# Altium schematic sheet F100C4T6B.SchDoc
size A4
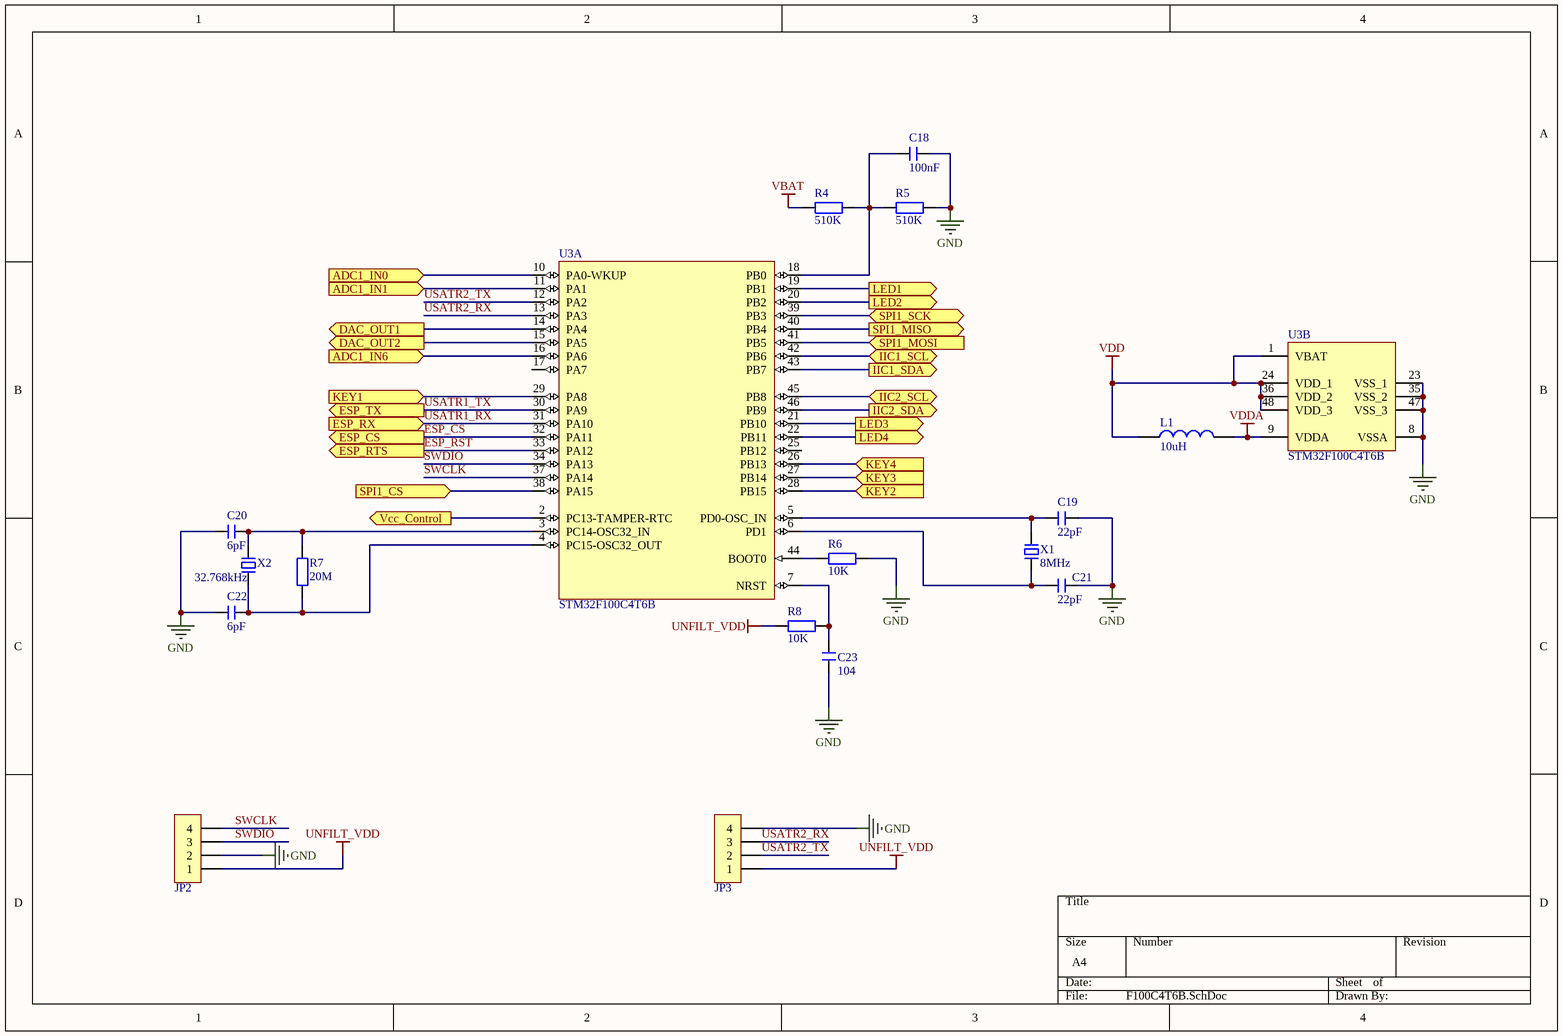
[diagram p0: F100C4T6B.SchDoc]

## Parts
C18  100nF  [C 0603_L]
C19  22pF  [C 0603_L]
C20  6pF  [C 0603_L]
C21  22pF  [C 0603_L]
C22  6pF  [C 0603_L]
C23  104  [C 0603_L]
JP2  HDR-1X4  [HDR2.54-LI-4P]  (value not drawn)
JP3  HDR-1X4  [HDR2.54-LI-4P]  (value not drawn)
L1  10uH  [L 0805]
R4  510K  [R 0603_L]
R5  510K  [R 0603_L]
R6  10K  [R 0603_L]
R7  20M  [R 0603_L]
R8  10K  [R 0603_L]
U3  STM32F100C4T6B  [LQFP48_N]  (parts A,B of 2)
X1  8MHz  [OSC 5032-2P]
X2  32.768kHz  [OSC 3215-2P]

## Ports
ADC1_IN0 (in), ADC1_IN1 (in), ADC1_IN6 (in), DAC_OUT1 (out), DAC_OUT2 (out), ESP_CS (out), ESP_RTS (out), ESP_RX (in), ESP_TX (out), IIC1_SCL (bidir), IIC1_SDA (out), IIC2_SCL (bidir), IIC2_SDA (out), KEY1 (in), KEY2 (in), KEY3 (in), KEY4 (in), LED1 (out), LED2 (out), LED3 (out), LED4 (out), SPI1_CS (in), SPI1_MISO (out), SPI1_MOSI (in), SPI1_SCK (bidir), Vcc_Control (out)

## Nets
GND: C18.1 C19.2 C20.2 C21.2 C22.2 C23.1 JP2.2 JP3.4 R5.1 R6.2 U3.8(VSSA) U3.23(VSS_1) U3.35(VSS_2) U3.47(VSS_3)
UNFILT_VDD: JP2.1 JP3.1 R8.2
VBAT: R4.2
VDD: L1.1 U3.1(VBAT) U3.24(VDD_1) U3.36(VDD_2) U3.48(VDD_3)
VDDA: L1.2 U3.9(VDDA)
ADC1_IN0: U3.10(PA0-WKUP) ; port ADC1_IN0
ADC1_IN1: U3.11(PA1) ; port ADC1_IN1
ADC1_IN6: U3.16(PA6) ; port ADC1_IN6
DAC_OUT1: U3.14(PA4) ; port DAC_OUT1
DAC_OUT2: U3.15(PA5) ; port DAC_OUT2
ESP_CS: U3.32(PA11) ; port ESP_CS
ESP_RTS: U3.33(PA12) ; port ESP_RTS
IIC1_SCL: U3.42(PB6) ; port IIC1_SCL
IIC1_SDA: U3.43(PB7) ; port IIC1_SDA
IIC2_SCL: U3.45(PB8) ; port IIC2_SCL
IIC2_SDA: U3.46(PB9) ; port IIC2_SDA
KEY1: U3.29(PA8) ; port KEY1
KEY2: U3.28(PB15) ; port KEY2
KEY3: U3.27(PB14) ; port KEY3
KEY4: U3.26(PB13) ; port KEY4
LED1: U3.19(PB1) ; port LED1
LED2: U3.20(PB2) ; port LED2
LED3: U3.21(PB10) ; port LED3
LED4: U3.22(PB11) ; port LED4
SPI1_CS: U3.38(PA15) ; port SPI1_CS
SPI1_MISO: U3.40(PB4) ; port SPI1_MISO
SPI1_MOSI: U3.41(PB5) ; port SPI1_MOSI
SPI1_SCK: U3.39(PB3) ; port SPI1_SCK
SWCLK: JP2.4 U3.37(PA14)
SWDIO: JP2.3 U3.34(PA13)
USATR1_RX: U3.31(PA10) ; port ESP_RX
USATR1_TX: U3.30(PA9) ; port ESP_TX
USATR2_RX: JP3.3 U3.13(PA3)
USATR2_TX: JP3.2 U3.12(PA2)
Vcc_Control: U3.2(PC13-TAMPER-RTC) ; port Vcc_Control
NetC18_2: C18.2 R4.1 R5.2 U3.18(PB0)
NetC19_1: C19.1 U3.5(PD0-OSC_IN) X1.2
NetC20_1: C20.1 R7.1 U3.3(PC14-OSC32_IN) X2.1
NetC21_1: C21.1 U3.6(PD1) X1.1
NetC22_1: C22.1 R7.2 U3.4(PC15-OSC32_OUT) X2.2
NetC23_2: C23.2 R8.1 U3.7(NRST)
NetR6_1: R6.1 U3.44(BOOT0)

Not connected (* = marked no-connect by the designer): U3 17(PA7) 25(PB12)

## Notes on the sheet
- ESP_CS
- ESP_RST

## Library data of the parts
C18-C23 = C: 贴片电容; BOM名称: 无极性贴片电容; 淘宝ID: 封装库来自淘宝 ID：黄晶宝石; 联系售后，技术支持: https://shop463601444.taobao.com; 唯一出售店铺网址: https://shop463601444.taobao.com
JP2 JP3 = Header 4: 4P接插件; 版权归属: 封装库来自淘宝 ID：黄晶宝石; BOM名称: 4P接插件; 学习资源: https://shop463601444.taobao.com
L1 = L: 小功率贴片电感; 淘宝ID: 封装库来自淘宝 ID：黄晶宝石; 封装库来自淘宝卖家 ID：黄晶宝石: 其他店铺购入均为盗版，不享受售后技术支持服务，请立即申请退款; BOM名称: 小功率贴片电感; 联系售后: https://shop463601444.taobao.com
R4-R8 = R: 贴片电阻; 版权归属: 来自淘宝 ID：黄晶宝石; 封装库来自淘宝卖家 ID：黄晶宝石: 其他店铺购入均为盗版，不享受售后技术支持服务，请立即申请退款; BOM名称: 贴片电阻; 联系售后: https://shop463601444.taobao.com
U3 = STM32F100C4T6B: STM32 ARM-based 32-bit MCU Value Line with 16 kB Flash, 4 kB Internal RAM, Internal Code B, -40 to +85癈 Temperature, 48-Pin LQFP, Tray; DatasheetVersion: rev6.0, Apr-2011; PackageVersion: rev13, Apr-2011; PackageReference: LQFP48; PackageDescription: 48-Pin Low-Profile Quad Flat Pack, 7 x 7 mm Body, 0.5 mm Pitch (LQFP48); ComponentLink1Description: Manufacturer URL; ComponentLink1URL: http://www.st.com/; ComponentLink2Description: STM32F100 Datasheet; ComponentLink2URL: http://www.st.com/internet/com/TECHNICAL_RESOURCES/TECHNICAL_LITERATURE/DATASHEET/CD00251732.pdf; ComponentLink3Description: STM32 Family Web Page; ComponentLink3URL: www.st.com/stm32
X1 X2 = XTAL-2P: 2脚无源脚晶振; 版权归属: 封装库来自淘宝卖家 ID：黄晶宝石; BOM名称: 2脚无源脚晶振; 学习资源: https://shop463601444.taobao.com